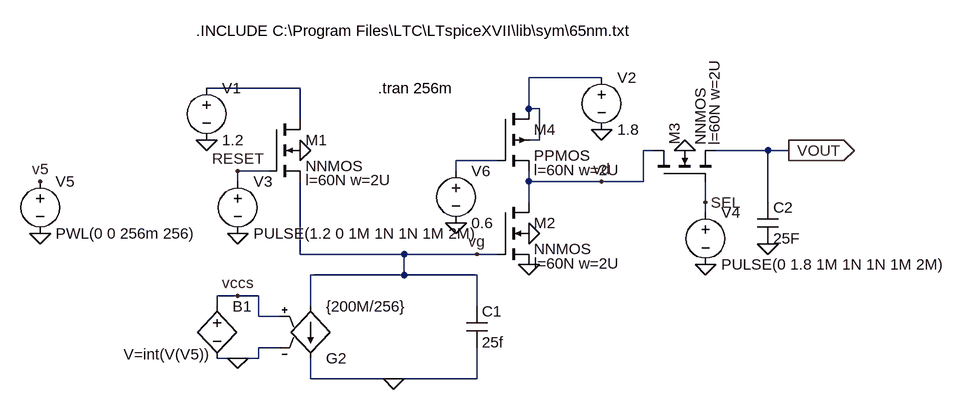
[diagram p0: schematic APS.asc]
APS.asc, the LTspice schematic file:
Version 4
SHEET 1 1092 680
WIRE 624 32 512 32
WIRE 160 48 16 48
WIRE 512 80 512 32
WIRE 528 80 512 80
WIRE 160 96 160 48
WIRE 528 128 528 80
WIRE 528 128 512 128
WIRE 704 144 688 144
WIRE 880 144 800 144
WIRE 912 144 880 144
WIRE 464 160 400 160
WIRE 112 176 64 176
WIRE 400 176 400 160
WIRE 64 192 64 176
WIRE 512 192 512 176
WIRE 624 192 512 192
WIRE 688 192 688 144
WIRE 688 192 624 192
WIRE 512 224 512 192
WIRE 784 224 784 192
WIRE 880 224 880 144
WIRE 784 240 784 224
WIRE 160 304 160 192
WIRE 320 304 160 304
WIRE 432 304 320 304
WIRE 464 304 432 304
WIRE 320 336 320 304
WIRE 320 336 176 336
WIRE 432 336 320 336
WIRE 64 368 32 368
WIRE 96 368 64 368
WIRE 32 384 32 368
WIRE 176 384 176 336
WIRE 432 384 432 336
WIRE 96 400 96 368
WIRE 128 400 96 400
WIRE 128 448 96 448
WIRE 64 464 32 464
WIRE 96 464 96 448
WIRE 96 464 64 464
WIRE 176 496 176 464
WIRE 304 496 176 496
WIRE 432 496 432 448
WIRE 432 496 304 496
FLAG 16 128 0
FLAG 64 272 0
FLAG -240 272 0
FLAG 160 144 0
FLAG 512 272 0
FLAG 752 144 0
FLAG 624 112 0
FLAG 784 320 0
FLAG 880 288 0
FLAG 304 496 0
FLAG 400 256 0
FLAG 912 144 VOUT
IOPIN 912 144 Out
FLAG 784 224 SEL
FLAG 64 176 RESET
FLAG 512 320 0
FLAG 64 368 vccs
FLAG 64 464 0
FLAG -240 192 v5
FLAG 432 304 vg
FLAG 624 192 vd
SYMBOL nmos4 112 96 R0
WINDOW 123 56 94 Left 2
SYMATTR InstName M1
SYMATTR Value NNMOS
SYMATTR Value2 l=60N w=2U
SYMBOL nmos4 464 224 R0
WINDOW 123 56 94 Left 2
SYMATTR InstName M2
SYMATTR Value NNMOS
SYMATTR Value2 l=60N w=2U
SYMBOL nmos4 704 192 R270
WINDOW 123 56 94 Left 2
SYMATTR InstName M3
SYMATTR Value NNMOS
SYMATTR Value2 l=60N w=2U
SYMBOL pmos4 464 80 R0
WINDOW 123 56 94 Left 2
SYMATTR InstName M4
SYMATTR Value PPMOS
SYMATTR Value2 l=60N w=2U
SYMBOL voltage 16 32 R0
SYMATTR InstName V1
SYMATTR Value 1.2
SYMBOL voltage 624 16 R0
WINDOW 123 0 0 Left 0
WINDOW 39 0 0 Left 0
SYMATTR InstName V2
SYMATTR Value 1.8
SYMBOL voltage 64 176 R0
WINDOW 123 0 0 Left 0
WINDOW 39 0 0 Left 0
SYMATTR InstName V3
SYMATTR Value PULSE(1.2 0 1M 1N 1N 1M 2M)
SYMBOL voltage 784 224 R0
SYMATTR InstName V4
SYMATTR Value PULSE(0 1.8 1M 1N 1N 1M 2M)
SYMBOL voltage -240 176 R0
WINDOW 123 0 0 Left 0
WINDOW 39 0 0 Left 0
SYMATTR InstName V5
SYMATTR Value PWL(0 0 256m 256)
SYMBOL cap 416 384 R0
SYMATTR InstName C1
SYMATTR Value 25f
SYMBOL cap 864 224 R0
SYMATTR InstName C2
SYMATTR Value 25F
SYMBOL voltage 400 160 R0
SYMATTR InstName V6
SYMATTR Value 0.6
SYMBOL g2 176 480 M180
SYMATTR InstName G2
SYMATTR Value {200M/256}
SYMBOL bv 32 368 R0
WINDOW 3 -144 90 Left 2
SYMATTR InstName B1
SYMATTR Value V=int(V(V5))
TEXT 280 48 Left 2 !.tran 256m
TEXT 0 -40 Left 2 !.INCLUDE C:\\Program Files\\LTC\\LTspiceXVII\\lib\\sym\\65nm.txt

The netlist it stands for:
* APS.asc
M1 N002 RESET vg 0 NNMOS l=60N w=2U
M2 vd vg 0 0 NNMOS l=60N w=2U
M3 vd SEL VOUT 0 NNMOS l=60N w=2U
M4 N001 N003 vd N001 PPMOS l=60N w=2U
V1 N002 0 1.2
V2 N001 0 1.8
V3 RESET 0 PULSE(1.2 0 1M 1N 1N 1M 2M)
V4 SEL 0 PULSE(0 1.8 1M 1N 1N 1M 2M)
V5 v5 0 PWL(0 0 256m 256)
C1 vg 0 25f
C2 VOUT 0 25F
V6 N003 0 0.6
G2 vg 0 vccs 0 {200M/256}
B1 vccs 0 V=int(V(V5))
.model NMOS NMOS
.model PMOS PMOS
.lib standard.mos
.tran 256m
.INCLUDE C:\Program Files\LTC\LTspiceXVII\lib\sym\65nm.txt
.backanno
.end